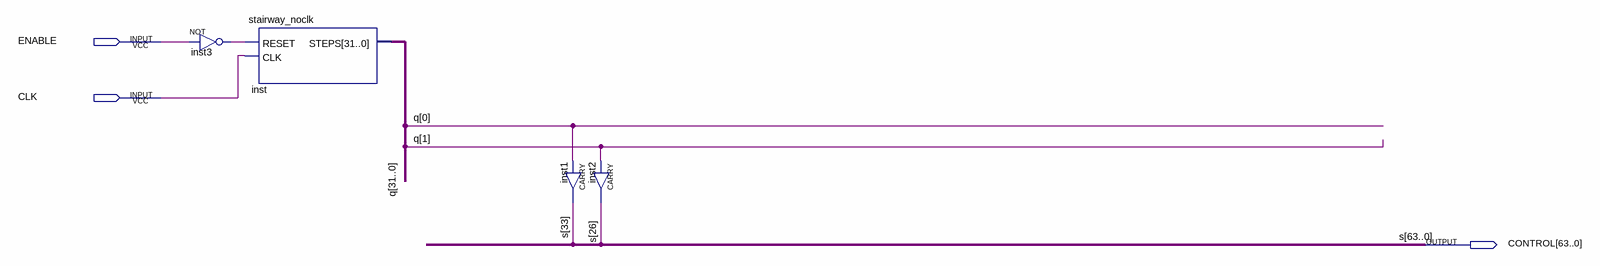
[diagram p0: schematic sheet]
// Quartus schematic macro_hlt.bdf as structural Verilog: 4 symbols, 3 pins
module macro_hlt (
  input  ENABLE,
  input  CLK,
  output [63:0] CONTROL
);

  wire inst3_out;
  wire [31:0] q;

  not inst3 (inst3_out, ENABLE);
  stairway_noclk inst (.RESET(inst3_out), .CLK(CLK), .STEPS(q));
  CARRY inst1 (.IN(q[0]), .OUT(CONTROL[33]));
  CARRY inst2 (.IN(q[1]), .OUT(CONTROL[26]));

  // Other names for the same wires on the sheet: s[63:0] = CONTROL
endmodule
